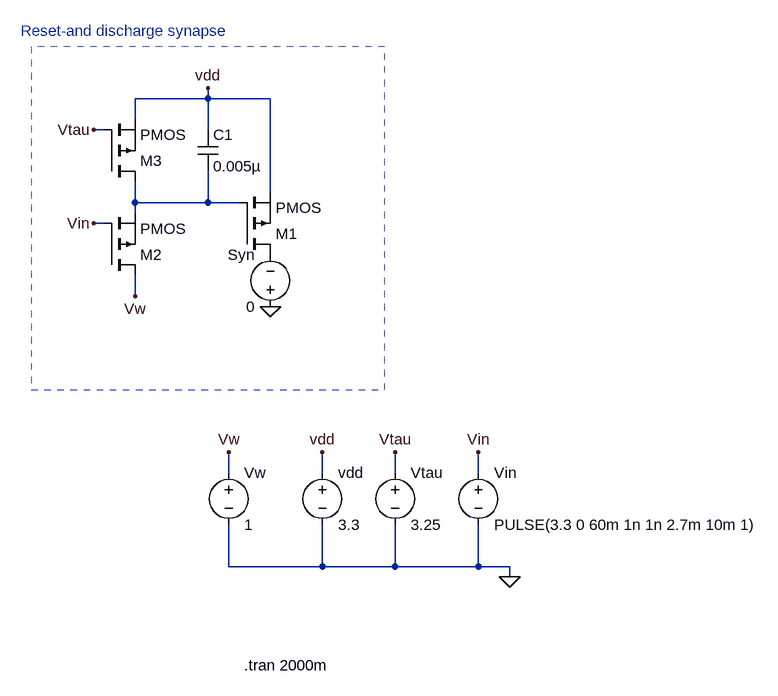
[diagram p0: schematic mm13_q2_IAndVSyn_working.asc]
mm13_q2_IAndVSyn_working.asc, the LTspice schematic file:
Version 4.1
SHEET 1 912 944
WIRE 32 0 32 -16
WIRE 32 0 -80 0
WIRE 128 0 32 0
WIRE -80 32 -80 0
WIRE -128 48 -144 48
WIRE 32 48 32 0
WIRE 128 144 128 0
WIRE -80 160 -80 128
WIRE 32 160 32 112
WIRE 32 160 -80 160
WIRE 80 160 32 160
WIRE -80 176 -80 160
WIRE -128 192 -144 192
WIRE -80 304 -80 272
WIRE 64 576 64 544
WIRE 208 576 208 544
WIRE 320 576 320 544
WIRE 448 576 448 544
WIRE 64 720 64 656
WIRE 208 720 208 656
WIRE 208 720 64 720
WIRE 320 720 320 656
WIRE 320 720 208 720
WIRE 448 720 448 656
WIRE 448 720 320 720
WIRE 496 720 448 720
WIRE 496 736 496 720
FLAG 32 -16 vdd
FLAG -80 304 Vw
FLAG -144 192 Vin
FLAG -144 48 Vtau
FLAG 320 544 Vtau
FLAG 208 544 vdd
FLAG 448 544 Vin
FLAG 64 544 Vw
FLAG 496 736 0
FLAG 128 320 0
SYMBOL cap 16 48 R0
SYMATTR InstName C1
SYMATTR Value 0.005µ
SYMBOL pmos 80 240 M180
SYMATTR InstName M1
SYMBOL pmos -128 272 M180
SYMATTR InstName M2
SYMBOL pmos -128 128 M180
SYMATTR InstName M3
SYMBOL voltage 320 560 R0
WINDOW 123 0 0 Left 0
WINDOW 39 0 0 Left 0
SYMATTR InstName Vtau
SYMATTR Value 3.25
SYMBOL voltage 208 560 R0
SYMATTR InstName vdd
SYMATTR Value 3.3
SYMBOL voltage 448 560 R0
WINDOW 123 0 0 Left 0
WINDOW 39 0 0 Left 0
SYMATTR InstName Vin
SYMATTR Value PULSE(3.3 0 60m 1n 1n 2.7m 10m 1)
SYMBOL voltage 64 560 R0
WINDOW 123 0 0 Left 0
WINDOW 39 0 0 Left 0
SYMATTR InstName Vw
SYMATTR Value 1
SYMBOL voltage 128 336 R180
WINDOW 0 24 96 Left 2
WINDOW 3 24 16 Left 2
SYMATTR InstName Syn
SYMATTR Value 0
TEXT -256 -104 Left 2 ;Reset-and discharge synapse
TEXT 88 872 Left 2 !.tran 2000m
RECTANGLE Normal -240 448 304 -80 2

The netlist it stands for:
* mm13_q2_IAndVSyn_working.asc
C1 vdd N001 0.005µ
M1 P001 N001 vdd vdd PMOS
M2 Vw Vin N001 N001 PMOS
M3 N001 Vtau vdd vdd PMOS
Vtau Vtau 0 3.25
vdd vdd 0 3.3
Vin Vin 0 PULSE(3.3 0 60m 1n 1n 2.7m 10m 1)
Vw Vw 0 1
V§Syn 0 P001 0
.model NMOS NMOS
.model PMOS PMOS
.lib standard.mos
* Reset-and discharge synapse
.tran 2000m
.backanno
.end